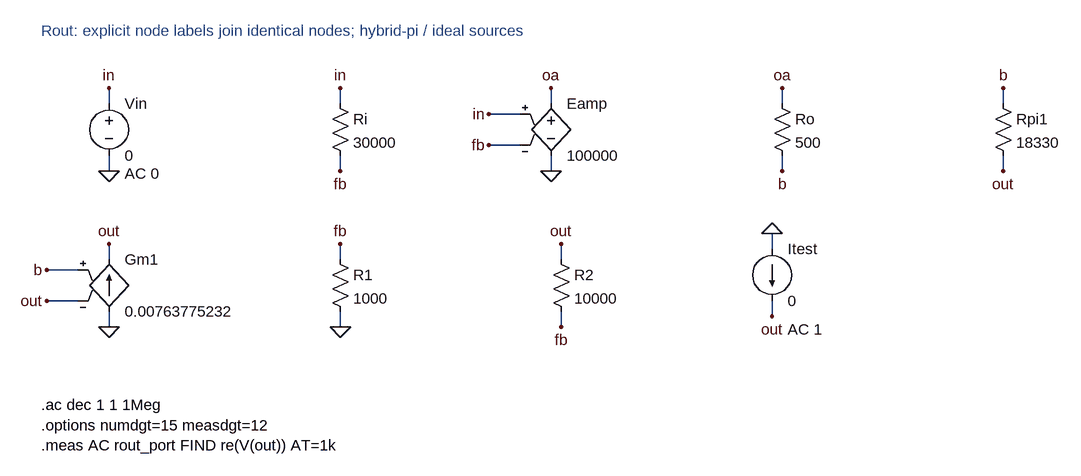
[diagram p0: schematic Rout.asc]
Rout.asc, the LTspice schematic file:
Version 4
SHEET 1 1800 1500
TEXT 16 -48 Left 2 ;Rout: explicit node labels join identical nodes; hybrid-pi / ideal sources
WIRE 120 64 120 40
FLAG 120 40 in
WIRE 120 144 120 168
FLAG 120 168 0
SYMBOL voltage 120 48 R0
SYMATTR InstName Vin
WINDOW 123 24 124 Left 2
SYMATTR Value 0
SYMATTR Value2 AC 0
WIRE 476 64 476 40
FLAG 476 40 in
WIRE 476 144 476 168
FLAG 476 168 fb
SYMBOL res 460 48 R0
SYMATTR InstName Ri
SYMATTR Value 30000
WIRE 800 64 800 40
FLAG 800 40 oa
WIRE 800 144 800 168
FLAG 800 168 0
WIRE 752 80 704 80
FLAG 704 80 in
WIRE 752 128 704 128
FLAG 704 128 fb
SYMBOL e 800 48 R0
SYMATTR InstName Eamp
SYMATTR Value 100000
WIRE 1156 64 1156 40
FLAG 1156 40 oa
WIRE 1156 144 1156 168
FLAG 1156 168 b
SYMBOL res 1140 48 R0
SYMATTR InstName Ro
SYMATTR Value 500
WIRE 1496 64 1496 40
FLAG 1496 40 b
WIRE 1496 144 1496 168
FLAG 1496 168 out
SYMBOL res 1480 48 R0
SYMATTR InstName Rpi1
SYMATTR Value 18330
WIRE 120 384 120 408
FLAG 120 408 0
WIRE 120 304 120 280
FLAG 120 280 out
WIRE 72 320 24 320
FLAG 24 320 b
WIRE 72 368 24 368
FLAG 24 368 out
SYMBOL g 120 288 R0
SYMATTR InstName Gm1
SYMATTR Value 0.00763775232
WIRE 476 304 476 280
FLAG 476 280 fb
WIRE 476 384 476 408
FLAG 476 408 0
SYMBOL res 460 288 R0
SYMATTR InstName R1
SYMATTR Value 1000
WIRE 816 304 816 280
FLAG 816 280 out
WIRE 816 384 816 408
FLAG 816 408 fb
SYMBOL res 800 288 R0
SYMATTR InstName R2
SYMATTR Value 10000
WIRE 1140 288 1140 264
FLAG 1140 264 0
WIRE 1140 368 1140 392
FLAG 1140 392 out
SYMBOL current 1140 288 R0
SYMATTR InstName Itest
WINDOW 123 24 124 Left 2
SYMATTR Value 0
SYMATTR Value2 AC 1
TEXT 16 528 Left 2 !.ac dec 1 1 1Meg\n.options numdgt=15 measdgt=12\n.meas AC rout_port FIND re(V(out)) AT=1k

The netlist it stands for:
* Rout.asc
Vin in 0 0 AC 0
Ri in fb 30000
Eamp oa 0 in fb 100000
Ro oa b 500
Rpi1 b out 18330
Gm1 0 out b out 0.00763775232
R1 fb 0 1000
R2 out fb 10000
Itest 0 out 0 AC 1
* Rout: explicit node labels join identical nodes; hybrid-pi / ideal sources
.ac dec 1 1 1Meg
.options numdgt=15 measdgt=12
.meas AC rout_port FIND re(V(out)) AT=1k
.backanno
.end

* Results of the author's LTspice run, read from the files saved beside the schematic
* From the log:
*   rout_port: re(V(out))=(-36.4012189379dB,0°) at 1000